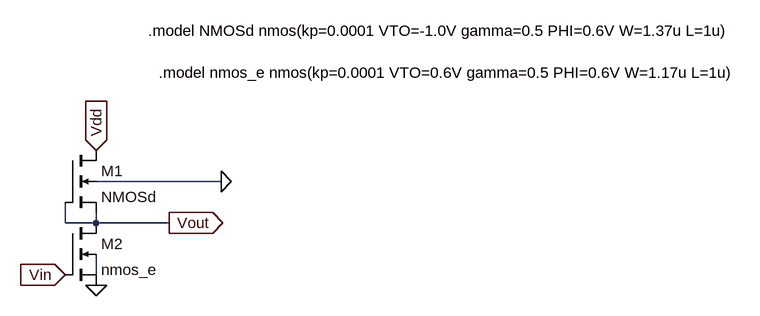
[diagram p0: schematic inverter_depletionload.asc]
inverter_depletionload.asc, the LTspice schematic file:
Version 4
SHEET 1 1176 680
WIRE 288 -272 96 -272
WIRE 48 -208 48 -240
WIRE 96 -208 96 -224
WIRE 96 -208 48 -208
WIRE 208 -208 96 -208
WIRE 96 -192 96 -208
WIRE 96 -128 96 -160
FLAG 288 -272 0
FLAG 96 -112 0
FLAG 96 -320 Vdd
IOPIN 96 -320 In
FLAG 48 -128 Vin
IOPIN 48 -128 In
FLAG 208 -208 Vout
IOPIN 208 -208 Out
SYMBOL nmos4 48 -208 R0
SYMATTR InstName M2
SYMATTR Value nmos_e
SYMBOL nmos4 48 -320 R0
SYMATTR InstName M1
SYMATTR Value NMOSd
TEXT 176 -504 Left 2 !.model NMOSd nmos(kp=0.0001 VTO=-1.0V gamma=0.5 PHI=0.6V W=1.37u L=1u)
TEXT 192 -440 Left 2 !.model nmos_e nmos(kp=0.0001 VTO=0.6V gamma=0.5 PHI=0.6V W=1.17u L=1u)

The netlist it stands for:
* inverter_depletionload.asc
M2 Vout Vin 0 N001 nmos_e
M1 Vdd Vout Vout 0 NMOSd
.model NMOS NMOS
.model PMOS PMOS
.lib standard.mos
.model NMOSd nmos(kp=0.0001 VTO=-1.0V gamma=0.5 PHI=0.6V W=1.37u L=1u)
.model nmos_e nmos(kp=0.0001 VTO=0.6V gamma=0.5 PHI=0.6V W=1.17u L=1u)
.backanno
.end